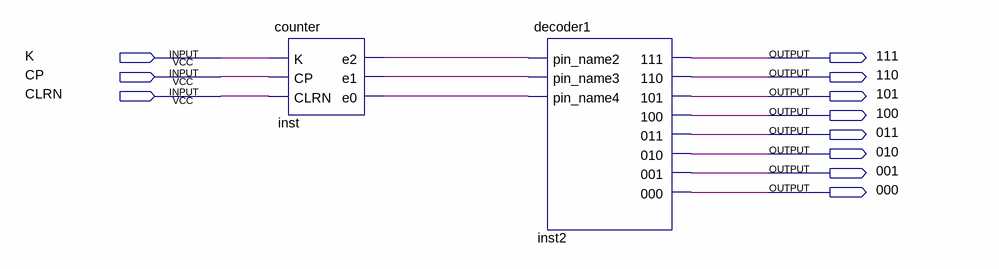
[diagram p0: schematic sheet]
// Quartus schematic logic8.bdf as structural Verilog: 2 symbols, 11 pins
module logic8 (
  input  K,
  input  CP,
  input  CLRN,
  output \111 ,
  output \110 ,
  output \101 ,
  output \100 ,
  output \011 ,
  output \010 ,
  output \001 ,
  output \000 
);

  wire inst_e0, inst_e1, inst_e2;

  counter inst (.K(K), .CP(CP), .CLRN(CLRN), .e2(inst_e2), .e1(inst_e1), .e0(inst_e0));
  decoder1 inst2 (
    .pin_name2(inst_e2), .pin_name3(inst_e1), .pin_name4(inst_e0), .\111 (\111 ), .\110 (\110 ),
    .\101 (\101 ), .\100 (\100 ), .\011 (\011 ), .\010 (\010 ), .\001 (\001 ), .\000 (\000 ));
endmodule
